# Altium schematic sheet Cover.SchDoc
size A4; SheetNumber: 1; SheetTotal: 4
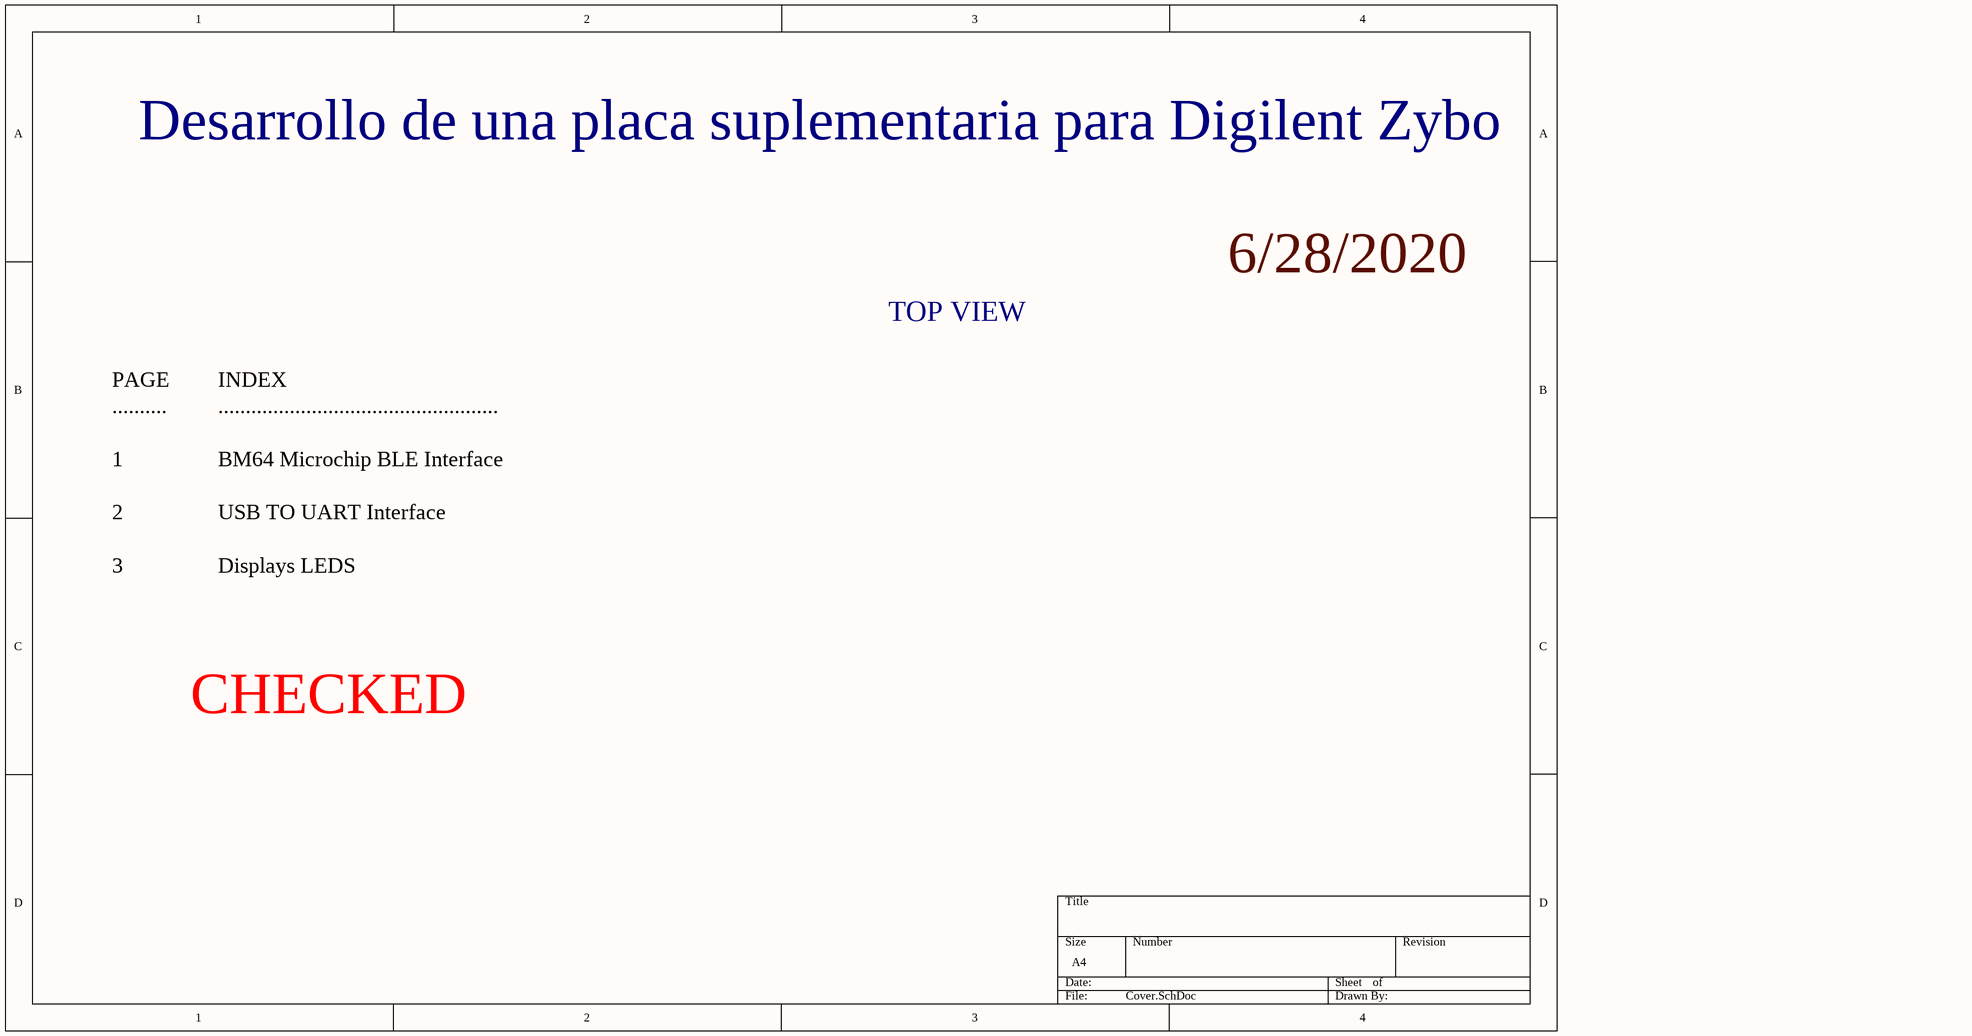
[diagram p0: Cover.SchDoc]

## Notes on the sheet
- Desarrollo de una placa suplementaria para Digilent Zybo
- 6/28/2020
- TOP VIEW
- PAGE
- ..........
- INDEX
- ...................................................
- 1
- BM64 Microchip BLE Interface
- 2
- 3
- USB TO UART Interface
- Displays LEDS
- CHECKED